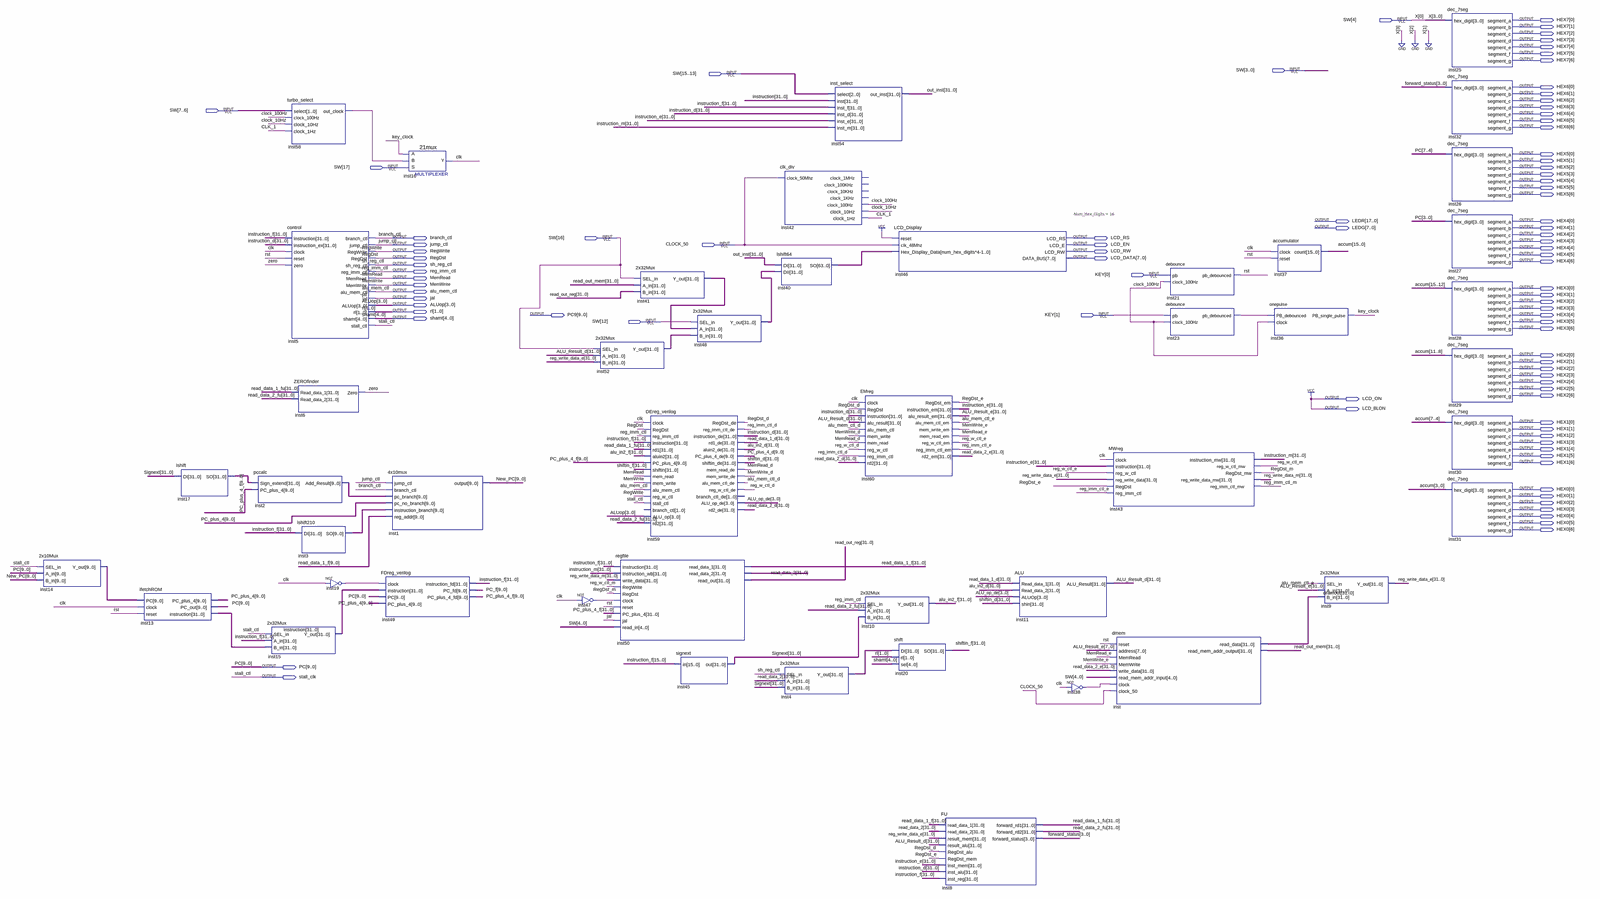
[diagram p0: schematic sheet, whole]
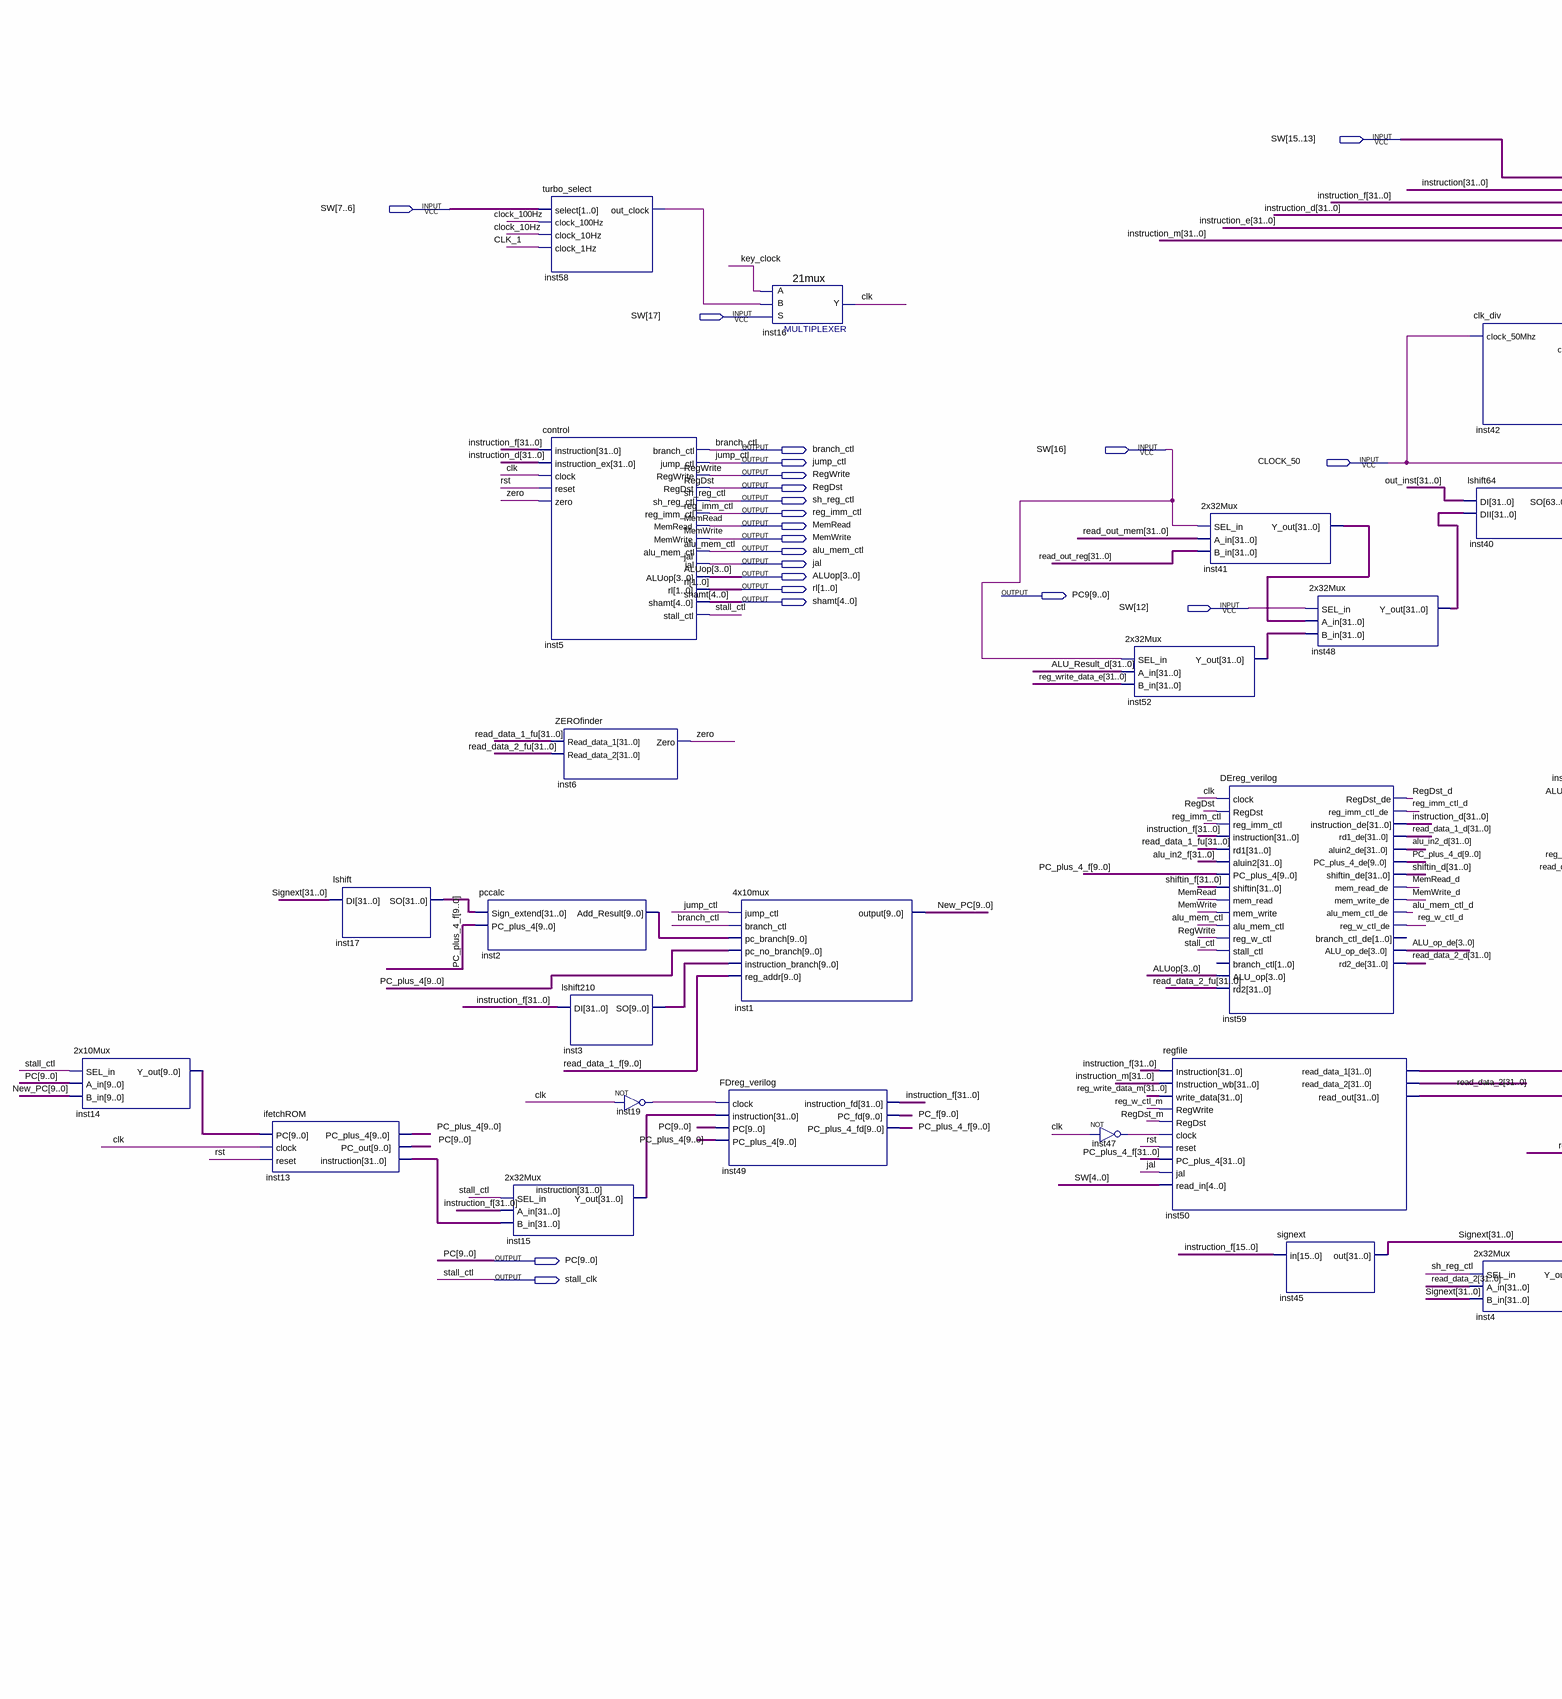
[diagram p1: schematic sheet, left part]
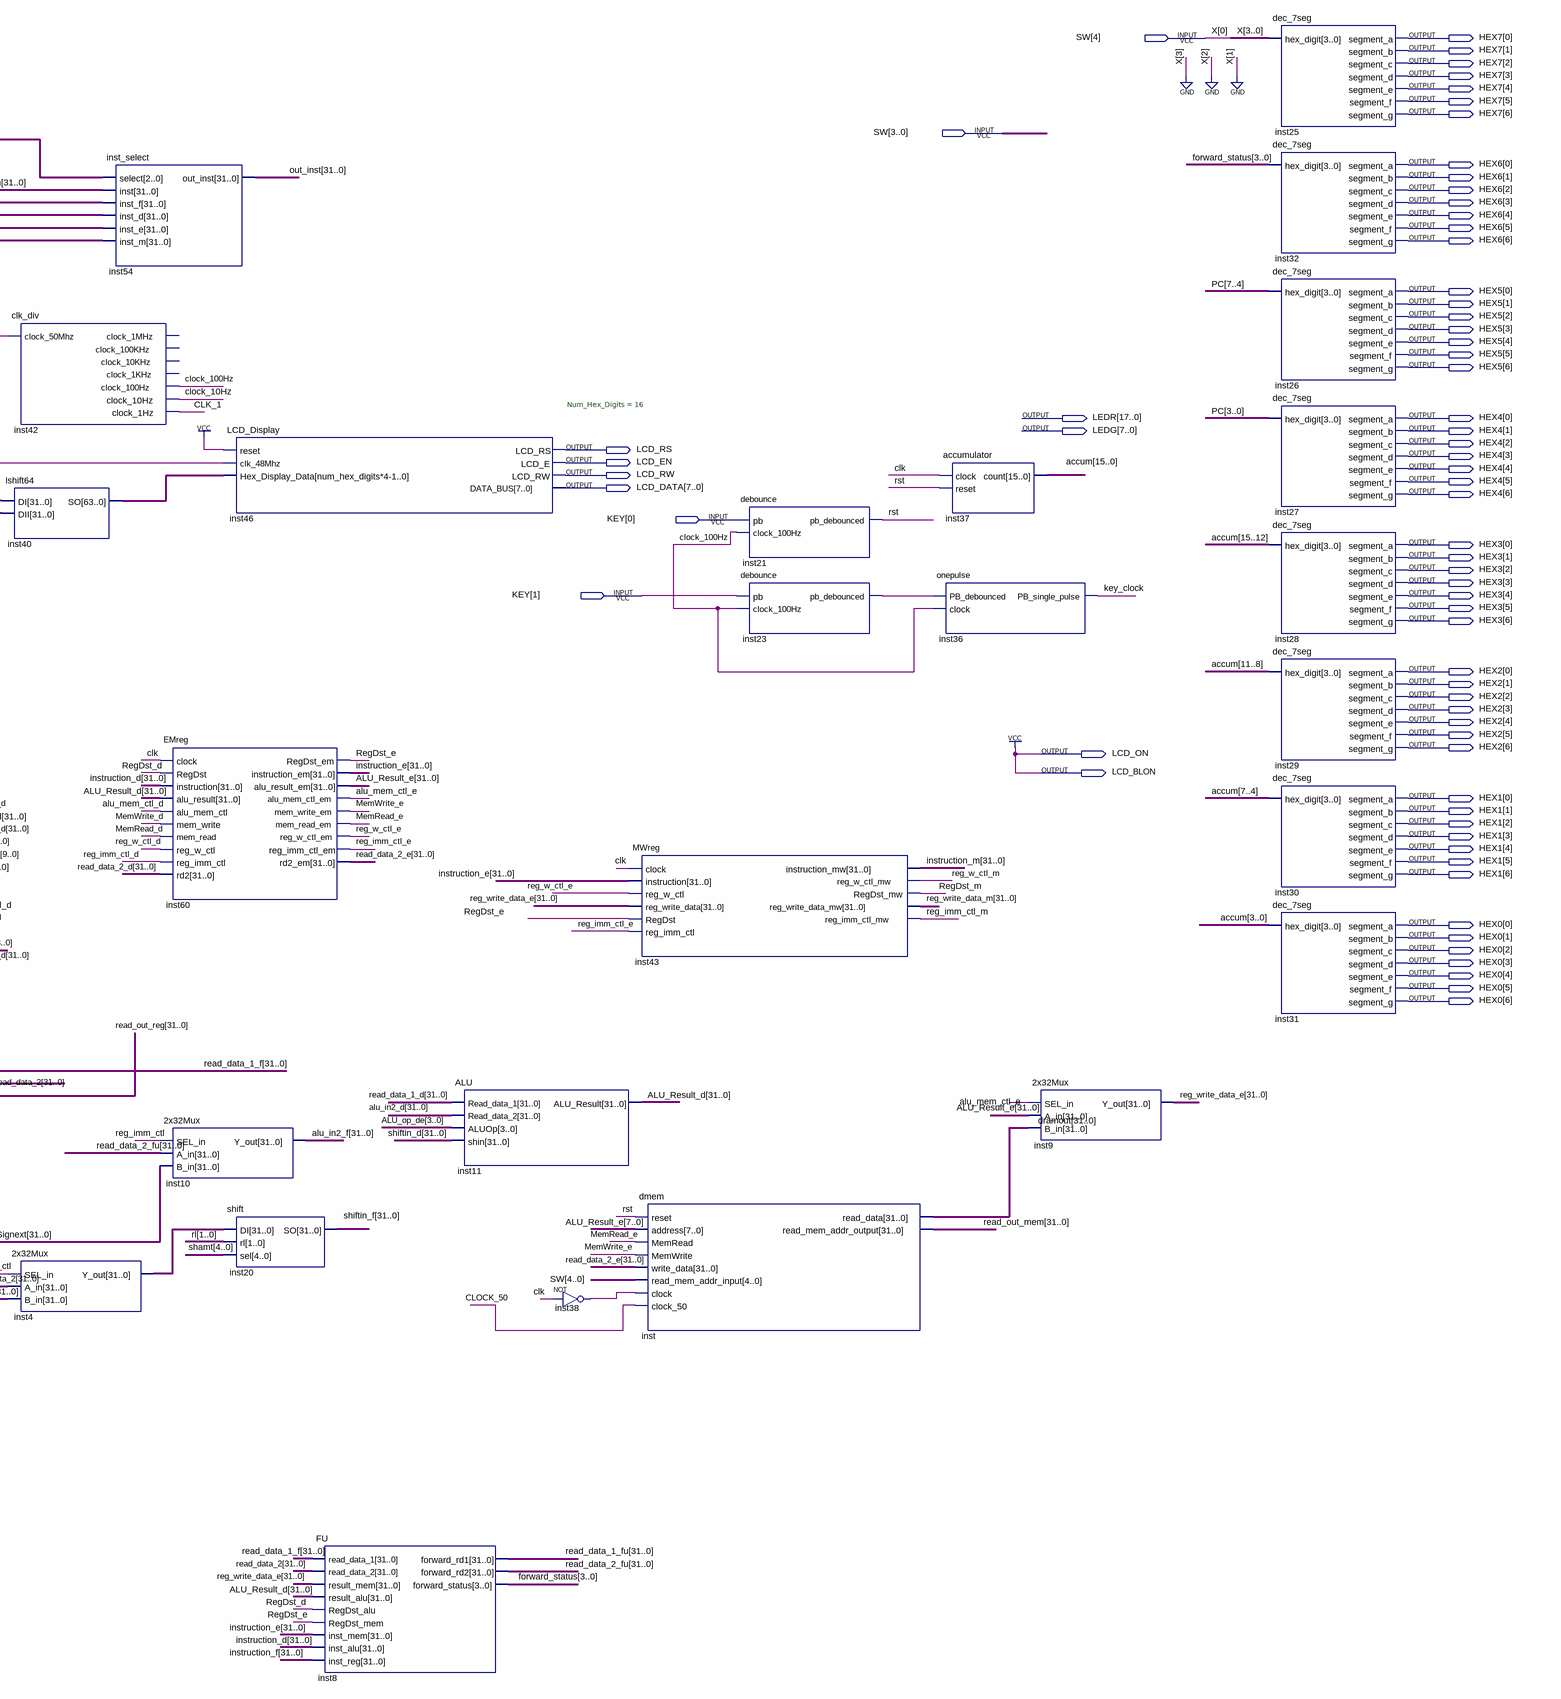
[diagram p2: schematic sheet, right part]
// Quartus schematic mips.bdf as structural Verilog: 46 symbols, 90 pins
module mips (
  input  [17:0] SW,
  input  CLOCK_50,
  input  [1:0] KEY,
  output [6:0] HEX7,
  output [6:0] HEX6,
  output [6:0] HEX5,
  output [17:0] LEDR,
  output [6:0] HEX4,
  output [7:0] LEDG,
  output branch_ctl,
  output LCD_RS,
  output jump_ctl,
  output LCD_EN,
  output RegWrite,
  output LCD_RW,
  output RegDst,
  output [7:0] LCD_DATA,
  output sh_reg_ctl,
  output reg_imm_ctl,
  output MemRead,
  output MemWrite,
  output [6:0] HEX3,
  output alu_mem_ctl,
  output jal,
  output [3:0] ALUop,
  output [1:0] rl,
  output [9:0] PC9,
  output [4:0] shamt,
  output [6:0] HEX2,
  output LCD_ON,
  output LCD_BLON,
  output [6:0] HEX1,
  output [6:0] HEX0,
  output [9:0] PC,
  output stall_clk
);

  wire alu_mem_ctl_d, alu_mem_ctl_e, clk, CLK_1, clock_10Hz, clock_100Hz, inst19_out, inst23_pb_debounced,
       inst38_out, inst47_out, inst58_out_clock, key_clock, MemRead_d, MemRead_e, MemWrite_d, MemWrite_e,
       reg_imm_ctl_d, reg_imm_ctl_e, reg_imm_ctl_m, reg_w_ctl_d, reg_w_ctl_e, reg_w_ctl_m, RegDst_d,
       RegDst_e, RegDst_m, rst, zero;
  wire [3:0] ALU_op_de, forward_status;
  wire [9:0] inst2_add_result, inst3_so, inst14_y_out, New_PC, PC_f, PC_plus_4, PC_plus_4_d;
  wire [15:0] accum;
  wire [31:0] alu_in2_d, alu_in2_f, ALU_Result_d, ALU_Result_e, dramout, inst4_y_out, inst13_instruction,
       inst17_so, inst41_y_out, inst48_y_out, inst52_y_out, instruction, instruction_d, instruction_e,
       instruction_f, instruction_m, out_inst, PC_plus_4_f, read_data_1_d, read_data_1_f, read_data_1_fu,
       read_data_2, read_data_2_d, read_data_2_e, read_data_2_fu, read_out_mem, read_out_reg,
       reg_write_data_e, reg_write_data_m, shiftin_d, shiftin_f, Signext;
  wire [63:0] inst40_so;

  \2x10Mux  inst14 (.SEL_in(stall_clk), .A_in(PC), .B_in(New_PC), .Y_out(inst14_y_out));
  ifetchROM inst13 (
    .PC(inst14_y_out), .clock(clk), .reset(rst), .PC_plus_4(PC_plus_4), .PC_out(PC),
    .instruction(inst13_instruction));
  lshift inst17 (.DI(Signext), .SO(inst17_so));
  pccalc inst2 (.Sign_extend(inst17_so), .PC_plus_4(PC_plus_4_f[9:0]), .Add_Result(inst2_add_result));
  \2x32Mux  inst15 (.SEL_in(stall_clk), .A_in(instruction_f), .B_in(inst13_instruction), .Y_out(instruction));
  turbo_select inst58 (
    .select(SW[7:6]), .clock_100Hz(clock_100Hz), .clock_10Hz(clock_10Hz), .clock_1Hz(CLK_1),
    .out_clock(inst58_out_clock));
  control inst5 (
    .instruction(instruction_f), .instruction_ex(instruction_d), .clock(clk), .reset(rst), .zero(zero),
    .branch_ctl(branch_ctl), .jump_ctl(jump_ctl), .RegWrite(RegWrite), .RegDst(RegDst),
    .sh_reg_ctl(sh_reg_ctl), .reg_imm_ctl(reg_imm_ctl), .MemRead(MemRead), .MemWrite(MemWrite),
    .alu_mem_ctl(alu_mem_ctl), .jal(jal), .ALUop(ALUop), .rl(rl), .shamt(shamt), .stall_ctl(stall_clk));
  ZEROfinder inst6 (.Read_data_1(read_data_1_fu), .Read_data_2(read_data_2_fu), .Zero(zero));
  lshift210 inst3 (.DI(instruction_f), .SO(inst3_so));
  not inst19 (inst19_out, clk);
  FDreg_verilog inst49 (
    .clock(inst19_out), .instruction(instruction), .PC(PC), .PC_plus_4(PC_plus_4),
    .instruction_fd(instruction_f), .PC_fd(PC_f), .PC_plus_4_fd(PC_plus_4_f[9:0]));
  \21mux  inst16 (.S(SW[17]), .B(inst58_out_clock), .A(key_clock), .Y(clk));
  \4x10mux  inst1 (
    .jump_ctl(jump_ctl), .branch_ctl(branch_ctl), .pc_branch(inst2_add_result), .pc_no_branch(PC_plus_4),
    .instruction_branch(inst3_so), .reg_addr(read_data_1_f[9:0]), .\output (New_PC));
  \2x32Mux  inst52 (.SEL_in(SW[16]), .A_in(ALU_Result_d), .B_in(reg_write_data_e), .Y_out(inst52_y_out));
  not inst47 (inst47_out, clk);
  regfile inst50 (
    .Instruction(instruction_f), .Instruction_wb(instruction_m), .write_data(reg_write_data_m),
    .RegWrite(reg_w_ctl_m), .RegDst(RegDst_m), .clock(inst47_out), .reset(rst), .PC_plus_4(PC_plus_4_f),
    .jal(jal), .read_in(SW[4:0]), .read_data_1(read_data_1_f), .read_data_2(read_data_2),
    .read_out(read_out_reg));
  \2x32Mux  inst41 (.SEL_in(SW[16]), .A_in(read_out_mem), .B_in(read_out_reg), .Y_out(inst41_y_out));
  DEreg_verilog inst59 (
    .clock(clk), .RegDst(RegDst), .reg_imm_ctl(reg_imm_ctl), .instruction(instruction_f),
    .rd1(read_data_1_fu), .aluin2(alu_in2_f), .PC_plus_4(PC_plus_4_f[9:0]), .shiftin(shiftin_f),
    .mem_read(MemRead), .mem_write(MemWrite), .alu_mem_ctl(alu_mem_ctl), .reg_w_ctl(RegWrite),
    .stall_ctl(stall_clk), .ALU_op(ALUop), .rd2(read_data_2_fu), .RegDst_de(RegDst_d),
    .reg_imm_ctl_de(reg_imm_ctl_d), .instruction_de(instruction_d), .rd1_de(read_data_1_d),
    .aluin2_de(alu_in2_d), .PC_plus_4_de(PC_plus_4_d), .shiftin_de(shiftin_d), .mem_read_de(MemRead_d),
    .mem_write_de(MemWrite_d), .alu_mem_ctl_de(alu_mem_ctl_d), .reg_w_ctl_de(reg_w_ctl_d),
    .ALU_op_de(ALU_op_de), .rd2_de(read_data_2_d));  // open: branch_ctl, branch_ctl_de
  signext inst45 (.in(instruction_f[15:0]), .out(Signext));
  \2x32Mux  inst48 (.SEL_in(SW[12]), .A_in(inst41_y_out), .B_in(inst52_y_out), .Y_out(inst48_y_out));
  clk_div inst42 (
    .clock_50Mhz(CLOCK_50), .clock_100Hz(clock_100Hz), .clock_10Hz(clock_10Hz), .clock_1Hz(CLK_1));  // open: clock_1MHz, clock_100KHz, clock_10KHz, clock_1KHz
  lshift64 inst40 (.DI(out_inst), .DII(inst48_y_out), .SO(inst40_so));
  \2x32Mux  inst4 (.SEL_in(sh_reg_ctl), .A_in(read_data_2), .B_in(Signext), .Y_out(inst4_y_out));
  inst_select inst54 (
    .select(SW[15:13]), .inst(instruction), .inst_f(instruction_f), .inst_d(instruction_d),
    .inst_e(instruction_e), .inst_m(instruction_m), .out_inst(out_inst));
  EMreg inst60 (
    .clock(clk), .RegDst(RegDst_d), .instruction(instruction_d), .alu_result(ALU_Result_d),
    .alu_mem_ctl(alu_mem_ctl_d), .mem_write(MemWrite_d), .mem_read(MemRead_d), .reg_w_ctl(reg_w_ctl_d),
    .reg_imm_ctl(reg_imm_ctl_d), .rd2(read_data_2_d), .RegDst_em(RegDst_e), .instruction_em(instruction_e),
    .alu_result_em(ALU_Result_e), .alu_mem_ctl_em(alu_mem_ctl_e), .mem_write_em(MemWrite_e),
    .mem_read_em(MemRead_e), .reg_w_ctl_em(reg_w_ctl_e), .reg_imm_ctl_em(reg_imm_ctl_e),
    .rd2_em(read_data_2_e));
  \2x32Mux  inst10 (.SEL_in(reg_imm_ctl), .A_in(read_data_2_fu), .B_in(Signext), .Y_out(alu_in2_f));
  LCD_Display #(.Num_Hex_Digits(16)) inst46 (
    .reset(1'b1), .clk_48Mhz(CLOCK_50), .Hex_Display_Data(inst40_so), .LCD_RS(LCD_RS), .LCD_E(LCD_EN),
    .LCD_RW(LCD_RW), .DATA_BUS(LCD_DATA));
  shift inst20 (.DI(inst4_y_out), .rl(rl), .sel(shamt), .SO(shiftin_f));
  FU inst8 (
    .read_data_1(read_data_1_f), .read_data_2(read_data_2), .result_mem(reg_write_data_e),
    .result_alu(ALU_Result_d), .RegDst_alu(RegDst_d), .RegDst_mem(RegDst_e), .inst_mem(instruction_e),
    .inst_alu(instruction_d), .inst_reg(instruction_f), .forward_rd1(read_data_1_fu),
    .forward_rd2(read_data_2_fu), .forward_status(forward_status));
  ALU inst11 (
    .Read_data_1(read_data_1_d), .Read_data_2(alu_in2_d), .ALUOp(ALU_op_de), .shin(shiftin_d),
    .ALU_Result(ALU_Result_d));
  not inst38 (inst38_out, clk);
  MWreg inst43 (
    .clock(clk), .instruction(instruction_e), .reg_w_ctl(reg_w_ctl_e), .reg_write_data(reg_write_data_e),
    .RegDst(RegDst_e), .reg_imm_ctl(reg_imm_ctl_e), .instruction_mw(instruction_m),
    .reg_w_ctl_mw(reg_w_ctl_m), .RegDst_mw(RegDst_m), .reg_write_data_mw(reg_write_data_m),
    .reg_imm_ctl_mw(reg_imm_ctl_m));
  dmem inst (
    .reset(rst), .address(ALU_Result_e[7:0]), .MemRead(MemRead_e), .MemWrite(MemWrite_e),
    .write_data(read_data_2_e), .read_mem_addr_input(SW[4:0]), .clock(inst38_out), .clock_50(CLOCK_50),
    .read_data(dramout), .read_mem_addr_output(read_out_mem));
  debounce inst21 (.pb(KEY[0]), .clock_100Hz(clock_100Hz), .pb_debounced(rst));
  debounce inst23 (.pb(KEY[1]), .clock_100Hz(clock_100Hz), .pb_debounced(inst23_pb_debounced));
  accumulator inst37 (.clock(clk), .reset(rst), .count(accum));
  onepulse inst36 (.PB_debounced(inst23_pb_debounced), .clock(clock_100Hz), .PB_single_pulse(key_clock));
  \2x32Mux  inst9 (.SEL_in(alu_mem_ctl_e), .A_in(ALU_Result_e), .B_in(dramout), .Y_out(reg_write_data_e));
  dec_7seg inst25 (
    .hex_digit({3'b000, SW[4]}), .segment_a(HEX7[0]), .segment_b(HEX7[1]), .segment_c(HEX7[2]),
    .segment_d(HEX7[3]), .segment_e(HEX7[4]), .segment_f(HEX7[5]), .segment_g(HEX7[6]));
  dec_7seg inst32 (
    .hex_digit(forward_status), .segment_a(HEX6[0]), .segment_b(HEX6[1]), .segment_c(HEX6[2]),
    .segment_d(HEX6[3]), .segment_e(HEX6[4]), .segment_f(HEX6[5]), .segment_g(HEX6[6]));
  dec_7seg inst26 (
    .hex_digit(PC[7:4]), .segment_a(HEX5[0]), .segment_b(HEX5[1]), .segment_c(HEX5[2]), .segment_d(HEX5[3]),
    .segment_e(HEX5[4]), .segment_f(HEX5[5]), .segment_g(HEX5[6]));
  dec_7seg inst27 (
    .hex_digit(PC[3:0]), .segment_a(HEX4[0]), .segment_b(HEX4[1]), .segment_c(HEX4[2]), .segment_d(HEX4[3]),
    .segment_e(HEX4[4]), .segment_f(HEX4[5]), .segment_g(HEX4[6]));
  dec_7seg inst28 (
    .hex_digit(accum[15:12]), .segment_a(HEX3[0]), .segment_b(HEX3[1]), .segment_c(HEX3[2]),
    .segment_d(HEX3[3]), .segment_e(HEX3[4]), .segment_f(HEX3[5]), .segment_g(HEX3[6]));
  dec_7seg inst29 (
    .hex_digit(accum[11:8]), .segment_a(HEX2[0]), .segment_b(HEX2[1]), .segment_c(HEX2[2]),
    .segment_d(HEX2[3]), .segment_e(HEX2[4]), .segment_f(HEX2[5]), .segment_g(HEX2[6]));
  dec_7seg inst30 (
    .hex_digit(accum[7:4]), .segment_a(HEX1[0]), .segment_b(HEX1[1]), .segment_c(HEX1[2]),
    .segment_d(HEX1[3]), .segment_e(HEX1[4]), .segment_f(HEX1[5]), .segment_g(HEX1[6]));
  dec_7seg inst31 (
    .hex_digit(accum[3:0]), .segment_a(HEX0[0]), .segment_b(HEX0[1]), .segment_c(HEX0[2]),
    .segment_d(HEX0[3]), .segment_e(HEX0[4]), .segment_f(HEX0[5]), .segment_g(HEX0[6]));

  assign LCD_BLON = 1'b1;
  assign LCD_ON = 1'b1;

  // Other names for the same wires on the sheet: stall_ctl = stall_clk; X[0] = SW[4]
endmodule
